# Altium schematic sheet OZ440-SE140-CAR001_sheet5_enable_delay.SchDoc
size A3
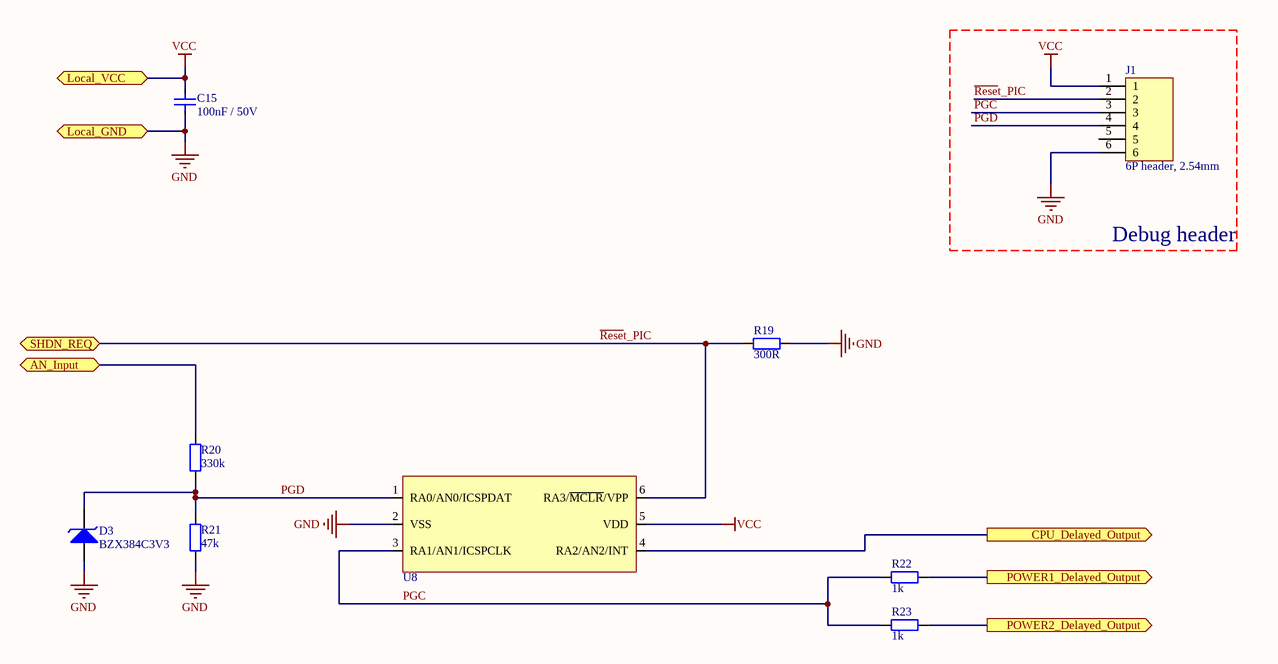
[diagram p0: OZ440-SE140-CAR001_sheet5_enable_delay.SchDoc]

## Parts
C15  Displayed reference: 100nF / 50V  [C0805-STD]  (hidden comment: CAP-SMD)
D3  Displayed reference: BZX384C3V3  [SOD323-SPE-BZX384]  (hidden comment: DIODE_ZENER-SOD323)
J1  Displayed reference: 6P header, 2.54mm  [6P_HEADER-STD_TH_1ROW]  (hidden comment: CONN-STD-6P_1ROW)
R19  Displayed reference: 300R  [R0805-STD]  (hidden comment: RES-SMD)
R20  Displayed reference: 330k  [R0805-STD]  (hidden comment: RES-SMD)
R21  Displayed reference: 47k  [R0805-STD]  (hidden comment: RES-SMD)
R22  Displayed reference: 1k  [R0805-STD]  (hidden comment: RES-SMD)
R23  Displayed reference: 1k  [R0805-STD]  (hidden comment: RES-SMD)
U8  PIC10F320-SOT23_6  [SOT23_6-SPE-PIC10F320]  (value not drawn)

## Ports
AN_Input, CPU_Delayed_Output (out), Local_GND, Local_VCC, POWER1_Delayed_Output (out), POWER2_Delayed_Output (out), SHDN_REQ

## Nets
GND: C15.2 D3.A J1.6 R19.2 R21.2 U8.2(VSS) ; port Local_GND
VCC: C15.1 J1.1 U8.5(VDD) ; port Local_VCC
~{Rese}t_PIC: J1.2 R19.1 U8.6(RA3/~{MCLR}/VPP) ; port SHDN_REQ
AN_Input: R20.2 ; port AN_Input
CPU_Delayed_Output: U8.4(RA2/AN2/INT) ; port CPU_Delayed_Output
PGC: J1.3 R22.1 R23.1 U8.3(RA1/AN1/ICSPCLK)
PGD: D3.K J1.4 R20.1 R21.1 U8.1(RA0/AN0/ICSPDAT)
POWER1_Delayed_Output: R22.2 ; port POWER1_Delayed_Output
POWER2_Delayed_Output: R23.2 ; port POWER2_Delayed_Output

Not connected (* = marked no-connect by the designer): J1 5

## Notes on the sheet
- Debug header
- Titre document:
- NAIO TECHNOLOGIES
- 3 Av didier Daurat
- 31400 TOULOUSE
- Auteur:
- Numéro document:
- Verificateur:
- Format:
- A3
- Date:
- Revision:
- Page:
- /

## Library data of the parts
C15 = VJ0805Y104KXAxx: 0805 100nF / 50V  X7R ceramic capacitor; Manufacturer: vishay; Max Voltage: 50; Tolerance: +/- 10%; Validated: N; Reference: VJ0805Y104KXAxx; Value: 100nF; Material: X7R; Footprint description: standard Capacitor 0805; Pin Count: 2; helpURL: http://www.vishay.com/docs/45200/highrels.pdf; Supplier 1: Farnell; Supplier Part Number 1: 1612208; Supplier 2: Digi-Key; Supplier Part Number 2: 720-1266-6-ND
D3 = BZX384C3V3: 3.3V zener diode; Manufacturer: VISHAY; Rated Power: 200mW; Validated: False; Reference: BZX384C3V3; component type: Zener diode; Value: 3.3V; Footprint description: SOD323; Pin Count: 2; Rev: 1.9; helpURL: http://www.vishay.com/docs/85764/bzx384.pdf; Supplier 1: Mouser; Supplier Part Number 1: 78-BZX384C3V3-E3-08; Supplier 2: Farnell; Supplier Part Number 2: 8735646
J1 = 68000-406HLF: 6P, 1 row, 2.54mm header; Manufacturer: FCI; Validated: False; Reference: 68000-406HLF; Footprint description: TH, 6 pin, 2.54mm; Pin Count: 6; Rev: DB; helpURL: http://portal.fciconnect.com/Comergent//fci/drawing/68000.pdf
R19 = CRCW0805300RFKxx: 300 ohm 0805 SMD resistor; Manufacturer: Vishay; Value: 300; Tolerance: 1%; Rated Power: 0.125W; Validated: No; Reference: CRCW0805300RFKxx; Footprint description: standard 0805 SMD; Pin Count: 2; helpURL: http://www.vishay.com/docs/20035/dcrcwe3.pdf; Supplier 1: Mouser; Supplier Part Number 1: 71-CRCW0805300RFKEA; Supplier 2: Farnell; Supplier Part Number 2: 1152346
R20 = CRCW0805330KFKxx: 330k Ohm 0805 SMD resistor; Manufacturer: Vishay; Value: 330 000; Tolerance: 1%; Rated Power: 0.125W; Validated: False; Reference: CRCW0805330KFKxx; Footprint description: standard 0805 SMD; Pin Count: 2; helpURL: http://www.vishay.com/docs/20035/dcrcwe3.pdf; Supplier 1: Farnell; Supplier Part Number 1: 2123444; Supplier 2: Mouser; Supplier Part Number 2: 71-CRCW0805330KFKEA
R21 = CRCW080547K0FKxx: 47k Ohm 0805 SMD resistor; Manufacturer: Vishay; Value: 47 000; Tolerance: 1 %; Rated Power: 0,125 W; Validated: No; Reference: CRCW080547K0FKxx; Footprint description: standard 0805 SMD; Pin Count: 2; helpURL: http://www.vishay.com/docs/20035/dcrcwe3.pdf; Supplier 1: Farnell; Supplier Part Number 1: 1469929; Supplier 2: Mouser; Supplier Part Number 2: 71-CRCW0805-47K-E3
R22 R23 = CRCW08051K00FKxx: 1k Ohm 0805 SMD resistor; Manufacturer: Vishay; Value: 1 000; Tolerance: 1 %; Rated Power: 0,125 W; Validated: No; Reference: CRCW08051K00FKxx; Footprint description: standard 0805 SMD; Pin Count: 2; helpURL: http://www.vishay.com/docs/20035/dcrcwe3.pdf; Supplier 1: Farnell; Supplier Part Number 1: 1469847; Supplier 2: Mouser; Supplier Part Number 2: 71-CRCW0805-1.0K-E3
U8 = PIC10F320T-I/OT: 6 pin Low cost microcontroller; Manufacturer: MICROCHIP; Validated: False; Reference: PIC10F320T-I/OT; Displayed reference: PIC10F320; Footprint description: SOT23 6 pin; Pin Count: 6; Rev: B; helpURL: http://ww1.microchip.com/downloads/en/DeviceDoc/40001585B.pdf; Supplier 1: Farnell; Supplier Part Number 1: 2315759; Supplier 2: Mouser; Supplier Part Number 2: 579-PIC10F320T-I/OT